# EAGLE design ACESDS1307BoBV2 (EAGLE 9.4.2)
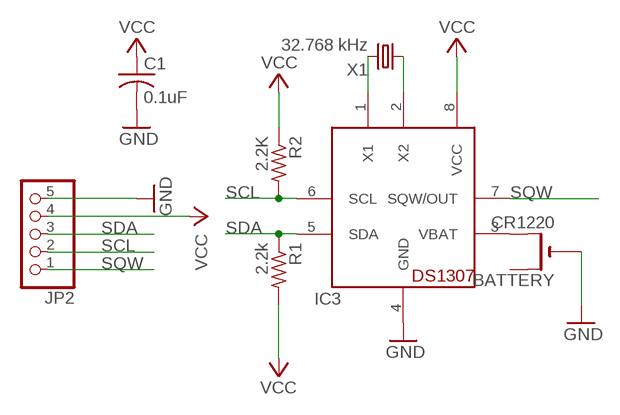
[diagram p0: schematic, sheet 1]

## Parts
BATTERY  CR1220  CR1220THM  [CR1220-THM]
C1  0.1uF  C-US025-025X050  [C025-025X050]
IC3  DS1307  [DIL08]
JP2  PINHD-1X5  [1X05]
R1  2.2k  R-US_0207/10  [0207/10]
R2  2.2K  R-US_0207/10  [0207/10]
X1  32.768 kHz  CRYTALTC38H  [TC38H]

## Nets
GND: BATTERY.- C1.2 IC3.4(GND) JP2.5
N$14: IC3.1(X1) X1.2
N$15: IC3.2(X2) X1.1
N$39: BATTERY.+2(+1) IC3.3(VBAT)
SCL: IC3.6(SCL) JP2.2 R2.2
SDA: IC3.5(SDA) JP2.3 R1.1
SQW: IC3.7(SQW/OUT) JP2.1
VCC: C1.1 IC3.8(VCC) JP2.4 R1.2 R2.1
Unconnected: BATTERY.+1(+)

## Library data of the parts
BATTERY = adafruit:CR1220: CR1216/CR1220/CR1225 12mm 3V lithium coin cell Great for battery packup. Both SMT and THM holders. Note the THM package has the ground pads on both sides of the PCB so that the masks are the same - this reduces the cost
C1 = adafruit:C-US: CAPACITOR, American symbol
IC3 = adafruit:DS1307: DS1307 Real time clock (RTC) with battery backup ability. Talk to it via i2c
JP2 = pinhead:PINHD-1X5: PIN HEADER
R1 R2 = adafruit:R-US_: RESISTOR, American symbol
X1 = crystal:CRYTAL: CRYSTAL

## Board
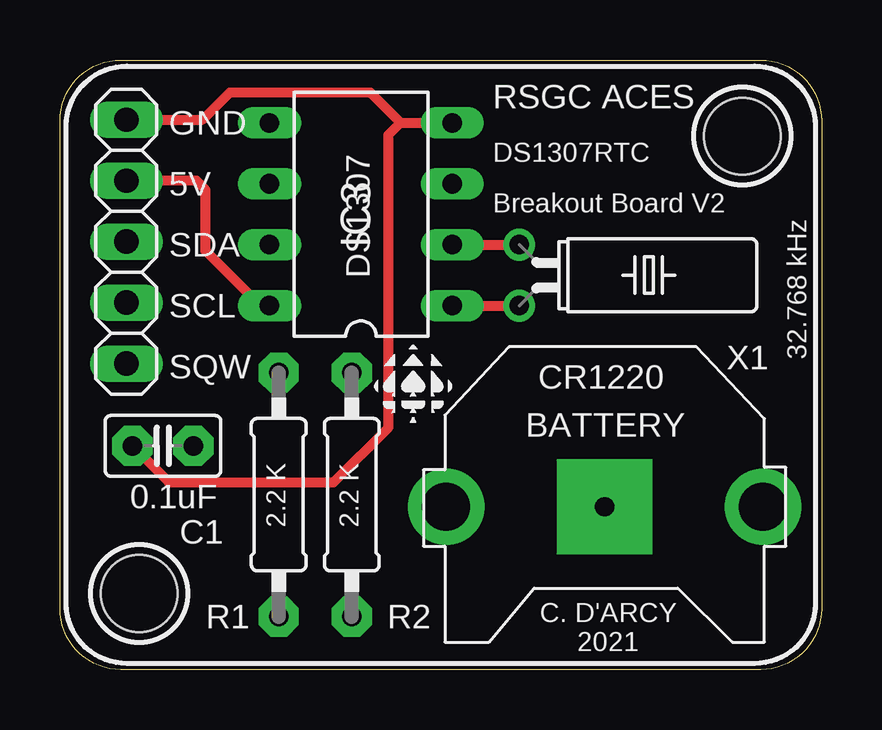
[diagram p1: board, top side]
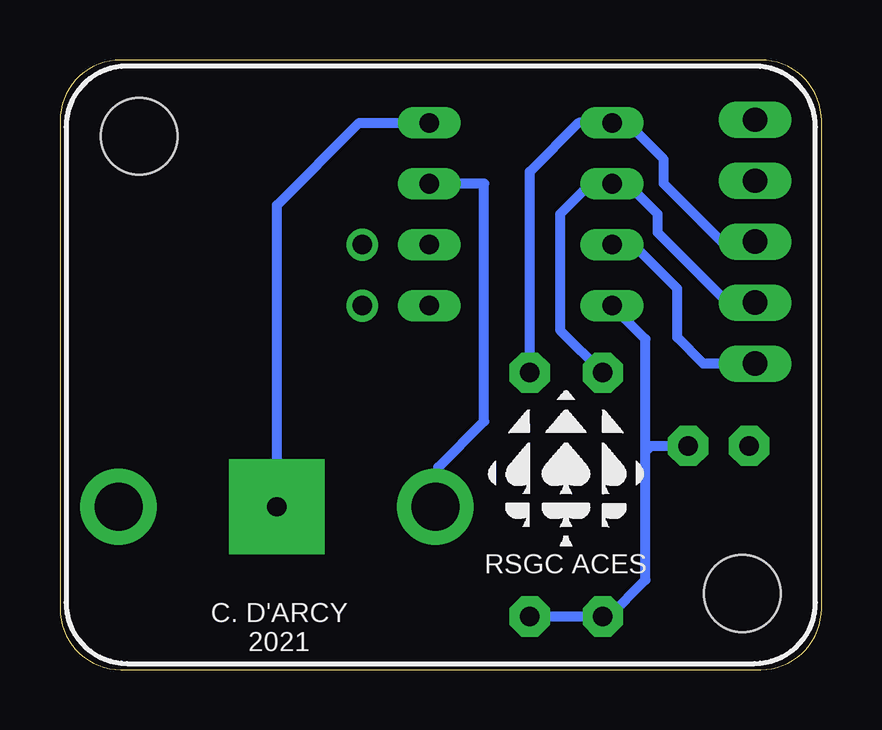
[diagram p2: board, bottom side, seen from below]

Size 31.75 x 25.4 mm. Coordinates in mm from the lower left corner, seen from the top.
Outline: 29.21,0 2.54,0 arc-90 0,2.54 0,22.86 arc-90 2.54,25.4 29.21,25.4 arc-90 31.75,22.86 31.75,2.54 arc-90 29.21,0
Copper layers (1*16): Top 0.035mm / dielectric 1.5mm / Bottom 0.035mm
Design rules "ACES_THT": minimum track width 8mil, minimum drill 0.35mm, track to track 10mil, track to pad 10mil, pad to pad 10mil, via to via 10mil, smd to smd 6mil, copper to edge 40mil, drill to drill 6mil, minimum pad ring 10mil, minimum via ring 8mil, stop-mask expansion 4mil, vias tented up to drill 0mil, thermal gap 10mil
Holes 3.2 mm at 28.45,22.23 3.3,3.17

### Footprints (pad centres in the part's own frame; a part is rotated, then mirrored left to right if it is on the bottom)
CR1220-THM = drill 2 pad 3.175: +1 -6.604,0; +2 6.604,0 | drill 0.8 pad 3.962 square: - 0,0
C025-025X050 = drill 0.813 pad 1.676 octagon: 1 -1.27,0; 2 1.27,0
DIL08 = drill 0.813 long: 1 -3.81,-3.81; 2 -1.27,-3.81; 3 1.27,-3.81; 4 3.81,-3.81; 5 3.81,3.81; 6 1.27,3.81; 7 -1.27,3.81; 8 -3.81,3.81
1X05 = drill 1.016 long: 1 -5.08,0; 2 -2.54,0; 3 0,0; 4 2.54,0; 5 5.08,0
0207/10 = drill 0.813 pad 1.676 octagon: 1 -5.08,0; 2 5.08,0
TC38H = drill 0.813: 1 -1.27,0; 2 1.27,0

### Placement (x,y rotation side)
BATTERY  22.71,6.78 180 top
C1  4.29,9.32 180 top
IC3  12.55,18.97 90 top
JP2  2.77,17.83 90 top
R1  12.17,7.29 270 top
R2  9.12,7.29 90 top
U$1  [MEDIUM_BSILK_TEXT]  10.67,8.13 0 top
U$2  [SMALL_TSILK]  14.73,11.94 0 top
X1  19.15,16.43 270 top

### Tracks (layer width: path | path; a pad name or v marks a point on that pad's centre or on a via)
GND
  Top 0.406: JP2.5 5.94,22.91 7.09,24.05 12.93,24.05 14.2,22.78 | C1.2 4.55,7.8 11.4,7.8 13.69,10.08 13.69,22.28 14.2,22.78 | 14.2,22.78 IC3.4
  Bottom 0.406: BATTERY.- 22.71,19.36 19.28,22.78 IC3.4
N$14
  Top 0.305: IC3.1 16.61,15.16 arc-90 16.74,15.04 arc-90 16.87,15.16
  Top 0.406: 16.87,15.16 X1.2
N$15
  Top 0.406: IC3.2 X1.1
N$39
  Bottom 0.406: IC3.3 14.07,20.24 14.07,10.34 15.98,8.43 15.98,6.78 BATTERY.+2
SCL
  Bottom 0.406: R2.2 10.9,14.15 10.9,18.97 9.63,20.24 IC3.6 8.1,20.24 6.83,18.97 6.83,18.21 3.91,15.29 JP2.2
SDA
  Bottom 0.406: R1.1 12.17,20.75 10.13,22.78 IC3.5 8.1,22.78 6.58,21.26 6.58,20.24 4.17,17.83 JP2.3
SQW
  Bottom 0.406: IC3.7 7.85,17.7 6.02,15.88 6.02,13.84 4.93,12.75 JP2.1
VCC
  Top 0.406: JP2.4 5.69,20.37 6.07,19.99 6.07,17.45 8.36,15.16 IC3.8
  Bottom 0.406: IC3.8 7.34,13.77 7.34,9.07 | 7.34,9.07 7.34,3.73 8.87,2.21 R2.1 R1.2 | C1.1 7.09,9.32 7.34,9.07

### Text on the board
tSilk: RSGC ACES | GND | DS1307RTC | 5V | Breakout Board V2 | SDA | SCL | SQW | 2.2 K | 2.2 K
_tsilk: C. D'ARCY / 2021
_bsilk: C. D'ARCY / 2021